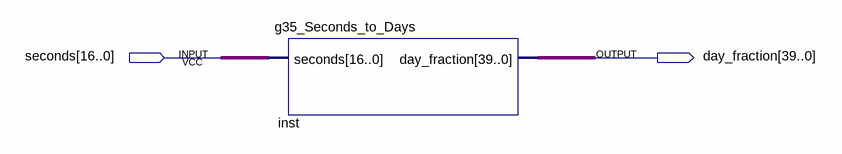
[diagram p0: schematic sheet]
// Quartus schematic g35_Seconds_to_Days_block.bdf as structural Verilog: 1 symbols, 2 pins
module g35_Seconds_to_Days_block (
  input  [16:0] seconds,
  output [39:0] day_fraction
);

  g35_Seconds_to_Days inst (.seconds(seconds), .day_fraction(day_fraction));
endmodule
